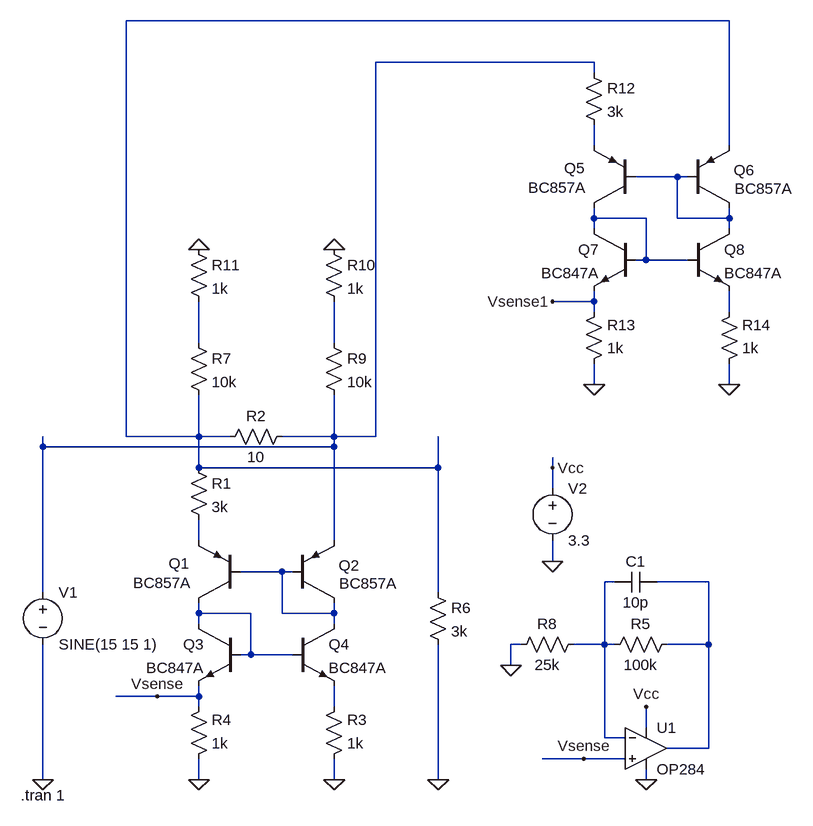
[diagram p0: schematic ZDS1009.asc]
ZDS1009.asc, the LTspice schematic file:
Version 4
SHEET 1 1112 680
WIRE 992 -736 64 -736
WIRE 784 -672 448 -672
WIRE 784 -656 784 -672
WIRE 784 -544 784 -576
WIRE 992 -544 992 -736
WIRE 912 -496 848 -496
WIRE 928 -496 912 -496
WIRE 784 -432 784 -448
WIRE 864 -432 784 -432
WIRE 912 -432 912 -496
WIRE 992 -432 992 -448
WIRE 992 -432 912 -432
WIRE 784 -416 784 -432
WIRE 992 -416 992 -432
WIRE 864 -368 864 -432
WIRE 864 -368 848 -368
WIRE 928 -368 864 -368
WIRE 784 -304 784 -320
WIRE 784 -304 720 -304
WIRE 784 -288 784 -304
WIRE 992 -288 992 -320
WIRE 176 -240 176 -304
WIRE 384 -240 384 -304
WIRE 784 -176 784 -208
WIRE 992 -176 992 -208
WIRE 64 -96 64 -736
WIRE 176 -96 176 -160
WIRE 176 -96 64 -96
WIRE 224 -96 176 -96
WIRE 384 -96 384 -160
WIRE 384 -96 304 -96
WIRE 448 -96 448 -672
WIRE 448 -96 384 -96
WIRE -64 -80 -64 -96
WIRE 384 -80 384 -96
WIRE 384 -80 -64 -80
WIRE 176 -48 176 -96
WIRE 544 -48 544 -96
WIRE 544 -48 176 -48
WIRE 720 -48 720 -64
WIRE 720 -16 720 -48
WIRE 176 64 176 32
WIRE 384 64 384 -80
WIRE 720 96 720 64
WIRE 304 112 240 112
WIRE 320 112 304 112
WIRE 816 128 800 128
WIRE 960 128 880 128
WIRE -64 144 -64 -80
WIRE 544 144 544 -48
WIRE 176 176 176 160
WIRE 256 176 176 176
WIRE 304 176 304 112
WIRE 384 176 384 160
WIRE 384 176 304 176
WIRE 176 192 176 176
WIRE 384 192 384 176
WIRE 672 224 656 224
WIRE 800 224 800 128
WIRE 800 224 752 224
WIRE 816 224 800 224
WIRE 960 224 960 128
WIRE 960 224 896 224
WIRE 256 240 256 176
WIRE 256 240 240 240
WIRE 320 240 256 240
WIRE 656 256 656 224
WIRE 112 304 48 304
WIRE 176 304 176 288
WIRE 176 304 112 304
WIRE 176 320 176 304
WIRE 384 320 384 288
WIRE 864 352 864 320
WIRE 800 368 800 224
WIRE 832 368 800 368
WIRE 960 384 960 224
WIRE 960 384 896 384
WIRE 768 400 704 400
WIRE 832 400 768 400
WIRE -64 432 -64 224
WIRE 176 432 176 400
WIRE 384 432 384 400
WIRE 544 432 544 224
WIRE 864 432 864 416
FLAG 176 432 0
FLAG 384 432 0
FLAG -64 432 0
FLAG 544 432 0
FLAG 112 304 Vsense
FLAG 864 320 Vcc
FLAG 864 432 0
FLAG 720 96 0
FLAG 720 -48 Vcc
FLAG 768 400 Vsense
FLAG 656 256 0
FLAG 176 -384 0
FLAG 384 -384 0
FLAG 784 -176 0
FLAG 992 -176 0
FLAG 720 -304 Vsense1
SYMBOL pnp 240 160 R180
WINDOW 0 78 61 Left 2
WINDOW 3 76 31 Left 2
SYMATTR InstName Q1
SYMATTR Value BC857A
SYMBOL pnp 320 160 M180
WINDOW 0 71 58 Left 2
WINDOW 3 72 30 Left 2
SYMATTR InstName Q2
SYMATTR Value BC857A
SYMBOL npn 240 192 M0
SYMATTR InstName Q3
SYMATTR Value BC847A
SYMBOL npn 320 192 R0
SYMATTR InstName Q4
SYMATTR Value BC847A
SYMBOL res 160 -64 R0
SYMATTR InstName R1
SYMATTR Value 3k
SYMBOL res 320 -112 R90
WINDOW 0 0 56 VBottom 2
WINDOW 3 32 56 VTop 2
SYMATTR InstName R2
SYMATTR Value 10
SYMBOL res 160 416 M180
WINDOW 0 36 76 Left 2
WINDOW 3 36 40 Left 2
SYMATTR InstName R4
SYMATTR Value 1k
SYMBOL res 368 416 M180
WINDOW 0 36 76 Left 2
WINDOW 3 36 40 Left 2
SYMATTR InstName R3
SYMATTR Value 1k
SYMBOL voltage -64 128 R0
WINDOW 123 0 0 Left 0
WINDOW 39 0 0 Left 0
SYMATTR InstName V1
SYMATTR Value SINE(15 15 1)
SYMBOL res 528 128 R0
SYMATTR InstName R6
SYMATTR Value 3k
SYMBOL Opamps\\OP284 864 320 R0
SYMATTR InstName U1
SYMBOL res 912 208 R90
WINDOW 0 0 56 VBottom 2
WINDOW 3 32 56 VTop 2
SYMATTR InstName R5
SYMATTR Value 100k
SYMBOL cap 880 112 R90
WINDOW 0 0 32 VBottom 2
WINDOW 3 32 32 VTop 2
SYMATTR InstName C1
SYMATTR Value 10p
SYMBOL res 768 208 R90
WINDOW 0 0 56 VBottom 2
WINDOW 3 32 56 VTop 2
SYMATTR InstName R8
SYMATTR Value 25k
SYMBOL voltage 720 -32 R0
WINDOW 123 0 0 Left 0
WINDOW 39 0 0 Left 0
SYMATTR InstName V2
SYMATTR Value 3.3
SYMBOL res 160 -256 R0
SYMATTR InstName R7
SYMATTR Value 10k
SYMBOL res 368 -256 R0
SYMATTR InstName R9
SYMATTR Value 10k
SYMBOL res 368 -400 R0
SYMATTR InstName R10
SYMATTR Value 1k
SYMBOL res 160 -400 R0
SYMATTR InstName R11
SYMATTR Value 1k
SYMBOL pnp 848 -448 R180
WINDOW 0 78 61 Left 2
WINDOW 3 76 31 Left 2
SYMATTR InstName Q5
SYMATTR Value BC857A
SYMBOL pnp 928 -448 M180
WINDOW 0 71 58 Left 2
WINDOW 3 72 30 Left 2
SYMATTR InstName Q6
SYMATTR Value BC857A
SYMBOL npn 848 -416 M0
SYMATTR InstName Q7
SYMATTR Value BC847A
SYMBOL npn 928 -416 R0
SYMATTR InstName Q8
SYMATTR Value BC847A
SYMBOL res 768 -672 R0
SYMATTR InstName R12
SYMATTR Value 3k
SYMBOL res 768 -192 M180
WINDOW 0 36 76 Left 2
WINDOW 3 36 40 Left 2
SYMATTR InstName R13
SYMATTR Value 1k
SYMBOL res 976 -192 M180
WINDOW 0 36 76 Left 2
WINDOW 3 36 40 Left 2
SYMATTR InstName R14
SYMATTR Value 1k
TEXT -98 456 Left 2 !.tran 1

The netlist it stands for:
* ZDS1009.asc
Q1 N013 N010 N009 0 BC857A
Q2 N010 N010 N002 0 BC857A
Q3 N013 N013 Vsense 0 BC847A
Q4 N010 N013 N014 0 BC847A
R1 N001 N009 3k
R2 N002 N001 10
R4 0 Vsense 1k
R3 0 N014 1k
V1 N002 0 SINE(15 15 1)
R6 N001 0 3k
XU1 Vsense N011 Vcc 0 N012 OP284  ; pins In+ In- V+ V- OUT
R5 N012 N011 100k
C1 N012 N011 10p
R8 N011 0 25k
V2 Vcc 0 3.3
R7 N007 N001 10k
R9 N008 N002 10k
R10 0 N008 1k
R11 0 N007 1k
Q5 N005 N004 N003 0 BC857A
Q6 N004 N004 N001 0 BC857A
Q7 N005 N005 Vsense1 0 BC847A
Q8 N004 N005 N006 0 BC847A
R12 N002 N003 3k
R13 0 Vsense1 1k
R14 0 N006 1k
.model NPN NPN
.model PNP PNP
.lib standard.bjt
.tran 1
.lib ADI1.lib
.backanno
.end